# Altium schematic sheet Sheet2-control.SchDoc
size A4; SheetNumber: 2; SheetTotal: 3
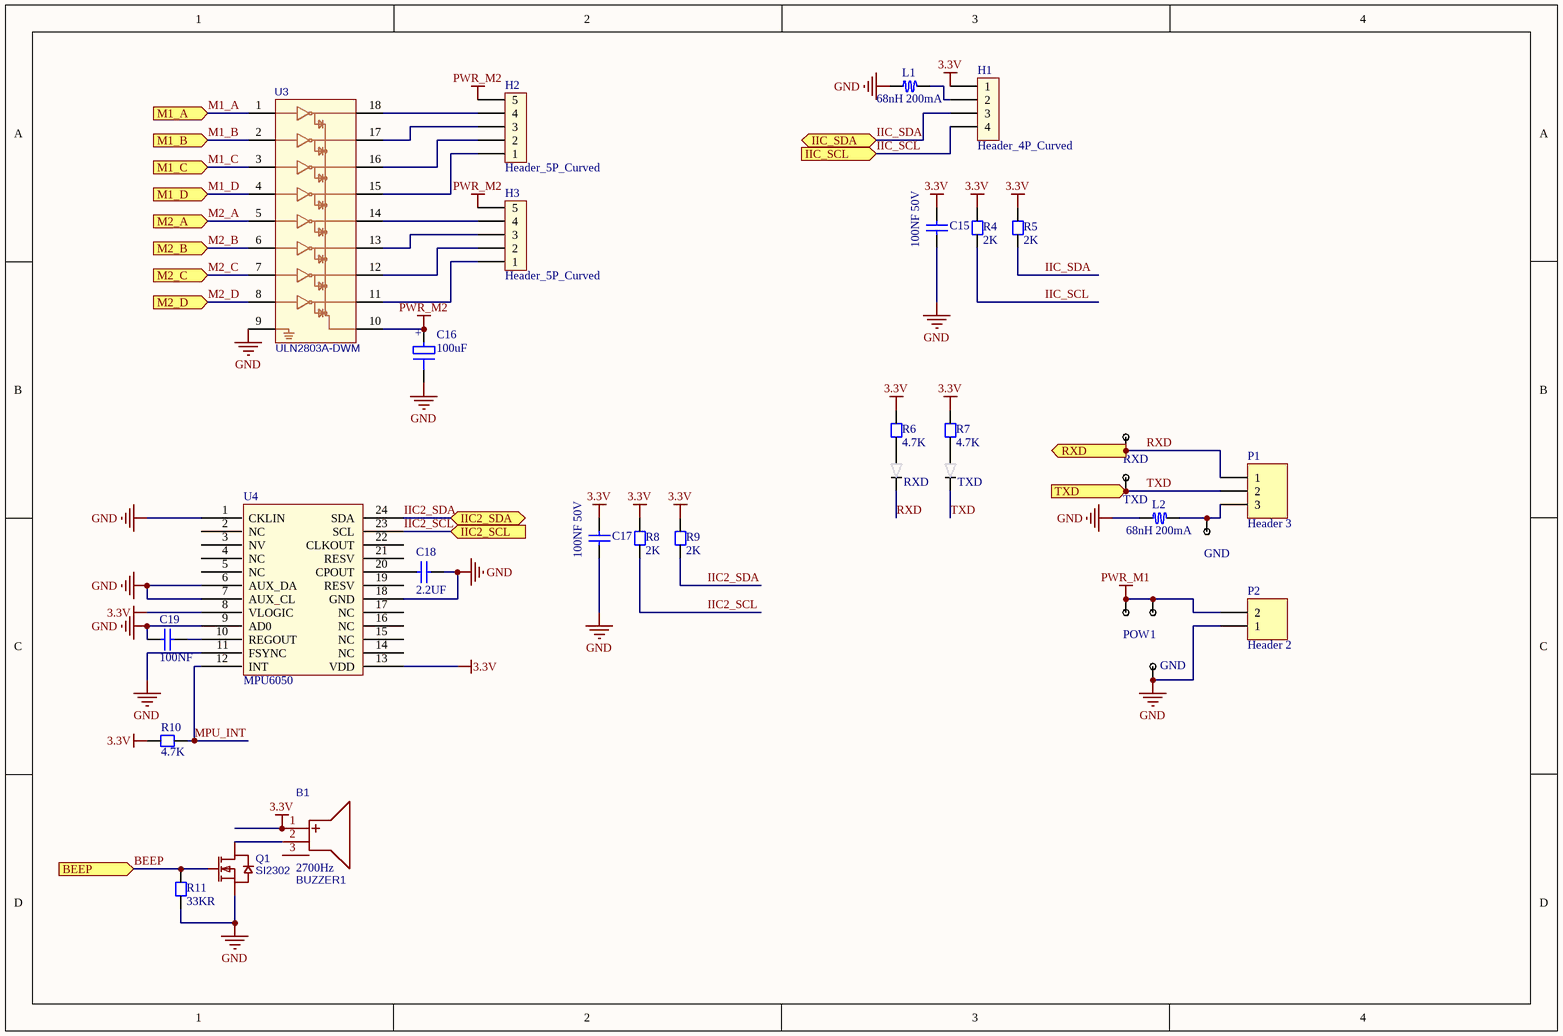
[diagram p0: Sheet2-control.SchDoc]

## Parts
(Parts that share a designator on the sheet are numbered #1, #2 ... from top to bottom, then left to right.)
1  pogopin  [pogopin]  (value not drawn)
B1  BUZZER1  [BUZ-SMD_GSC7525RA]
C15  100NF 50V  [CC1608-0603]
C16  100uF  [TAN-B_3528]
C17  100NF 50V  [CC1608-0603]
C18  2.2UF  [CC1608-0603]
C19  100NF  [CC1608-0603]
GND#1  pogopin  [pogopin]  (value not drawn)
GND#2  pogopin  [pogopin]  (value not drawn)
H1  Header_4P_Curved  [Header_2_54_4PW]
H2  Header_5P_Curved  [Header_2_54_5PW]
H3  Header_5P_Curved  [Header_2_54_5PW]
L1  68nH 200mA  [Inductor-0603]
L2  68nH 200mA  [Inductor-0603]
P1  Header 3  [HDR1X3]
P2  Header 2  [HDR1X2]
POW  pogopin  [pogopin]  (value not drawn)
Q1  SI2302  [SOT-23]
R4  2K  [CR1608-0603]
R5  2K  [CR1608-0603]
R6  4.7K  [CR1608-0603]
R7  4.7K  [CR1608-0603]
R8  2K  [CR1608-0603]
R9  2K  [CR1608-0603]
R10  4.7K  [CR1608-0603]
R11  33KR  [CR1608-0603]
RXD#1  pogopin  [pogopin]  (value not drawn)
RXD#2  LED 0603  [LED 0603]  (value not drawn)
TXD#1  LED 0603  [LED 0603]  (value not drawn)
TXD#2  pogopin  [pogopin]  (value not drawn)
U3  ULN2803A-DWM  [SOP-18]
U4  MPU6050  [QFN24 - duplicate]

## Ports
BEEP (in), IIC2_SCL (in), IIC2_SDA (bidir), IIC_SCL (in), IIC_SDA (bidir), M1_A (in), M1_B (in), M1_C (in), M1_D (in), M2_A (in), M2_B (in), M2_C (in), M2_D (in), RXD (out), TXD (in)

## Nets
3.3V: B1.1(+) C15.2 C17.2 H1.1 R4.1 R5.1 R6.1 R7.1 R8.1 R9.1 R10.1 U4.8(VLOGIC) U4.13(VDD)
GND: C15.1 C16.2(-) C17.1 C18.2 C19.1 GND#2.1 L1.1 L2.1 P2.1 Q1.2(S) R11.2 U3.9(GND) U4.1(CKLIN) U4.6(AUX_DA) U4.7(AUX_CL) U4.9(AD0) U4.11(FSYNC) U4.18(GND)
PWR_M1: 1.1 P2.2 POW.1
PWR_M2: C16.1(+) H2.5 H3.5 U3.10(COMMON)
BEEP: Q1.1(G) R11.1 ; port BEEP
IIC2_SCL: R8.2 U4.23(SCL) ; port IIC2_SCL
IIC2_SDA: R9.2 U4.24(SDA) ; port IIC2_SDA
IIC_SCL: H1.4 R4.2 ; port IIC_SCL
IIC_SDA: H1.3 R5.2 ; port IIC_SDA
M1_A: U3.1(I1) ; port M1_A
M1_B: U3.2(I2) ; port M1_B
M1_C: U3.3(I3) ; port M1_C
M1_D: U3.4(I4) ; port M1_D
M2_A: U3.5(I5) ; port M2_A
M2_B: U3.6(I6) ; port M2_B
M2_C: U3.7(I7) ; port M2_C
M2_D: U3.8(I8) ; port M2_D
MPU_INT: R10.2 U4.12(INT)
RXD: P1.1 RXD#1.1 RXD#2.2 ; port RXD
TXD: P1.2 TXD#1.2 TXD#2.1 ; port TXD
NetB1_2: B1.2(-) Q1.3(D)
NetC18_1: C18.1 U4.20(CPOUT)
NetC19_2: C19.2 U4.10(REGOUT)
NetGND#1_1: GND#1.1 L2.2 P1.3
NetH1_2: H1.2 L1.2
NetH2_1: H2.1 U3.15(O4)
NetH2_2: H2.2 U3.16(O3)
NetH2_3: H2.3 U3.17(O2)
NetH2_4: H2.4 U3.18(O1)
NetH3_1: H3.1 U3.11(O8)
NetH3_2: H3.2 U3.12(O7)
NetH3_3: H3.3 U3.13(O6)
NetH3_4: H3.4 U3.14(O5)
NetR6_2: R6.2 RXD#2.1
NetR7_2: R7.2 TXD#1.1

Not connected (* = marked no-connect by the designer): B1 3(EH); U4 2(NC) 3(NV) 4(NC) 5(NC) 14(NC) 15(NC) 16(NC) 17(NC) 19(RESV) 21(RESV) 22(CLKOUT)

## Library data of the parts
1 GND#1 GND#2 POW RXD#1 TXD#2 = pogopin: 插板式顶针 连接器弹簧天线插针SMT触点测试铜针双弹贴片式
B1 = BUZZER1: 2700Hz; Manufacturer: INGHAi(赢海); Manufacturer Part: GSC7525RA-16R2700; Contributor: LCSC; nameAlias: Value; Supplier: LCSC; Supplier Part: C255313; spicePre: B; spiceSymbolName: GSC7525RA-16R2700
C15 C17-C19 = Cap Chip 0603: 0603封装的电容; Published: 8-Jun-2000; Revision: July-2002: Re-released for DXP Platform.; Publisher: Altium Limited
C16 = CAP TAN-B-3528: 钽电容
H1 = Header_4P_Curved: 弯的4P排针
H2 H3 = Header_5P_Curved: 弯的6P排针
L1 L2 = Inductor-0603: 贴片电感 0603封装
P1 = Header 3: Header, 3-Pin; LatestRevisionDate: 17-Jul-2002; LatestRevisionNote: Re-released for DXP Platform.; Publisher: Altium Limited
P2 = Header 2: Header, 2-Pin; LatestRevisionDate: 17-Jul-2002; LatestRevisionNote: Re-released for DXP Platform.; Publisher: Altium Limited
Q1 = SI2302: N沟道 / 漏源电压(Vdss) 20V / 连续漏极电流(Id) 2.8A / 功率(Pd) 900mW / 导通电阻(RDS(on)@Vgs,Id) 55mΩ@4.5V,2.8A / 阈值电压(Vgs(th)@Id) 1.2V@250uA / 输入电容(Ciss@Vds) 260pF@10V; Manufacturer: TWGMC(台湾迪嘉); Manufacturer Part: SI2306; Contributor: LCSC; Supplier: LCSC; Supplier Part: C727154; JLCPCB Part Class: Extended Part; spicePre: Q; spiceSymbolName: SI2306_C727154
R4-R10 = Resistor Chip 0603: 0603封装电阻; Published: 8-Jun-2000; Revision: July-2002: Re-released for DXP Platform.; Publisher: Altium Limited
R11 = Chip resistor: 贴片电阻
U3 = ULN2803A: UMW ULN2803A SOP-18 达林顿阵列功率驱动集成电路芯片; Manufacturer: HGC(华冠); Manufacturer Part: ULN2803ADWM/TR; Contributor: lcsc; Supplier: LCSC; Supplier Part: C2683132; JLCPCB Part Class: Extended Part; spicePre: U; spiceSymbolName: ULN2803ADWM/TR
U4 = MPU6050: 陀螺仪